# Altium project mini-inverter.PrjPcb
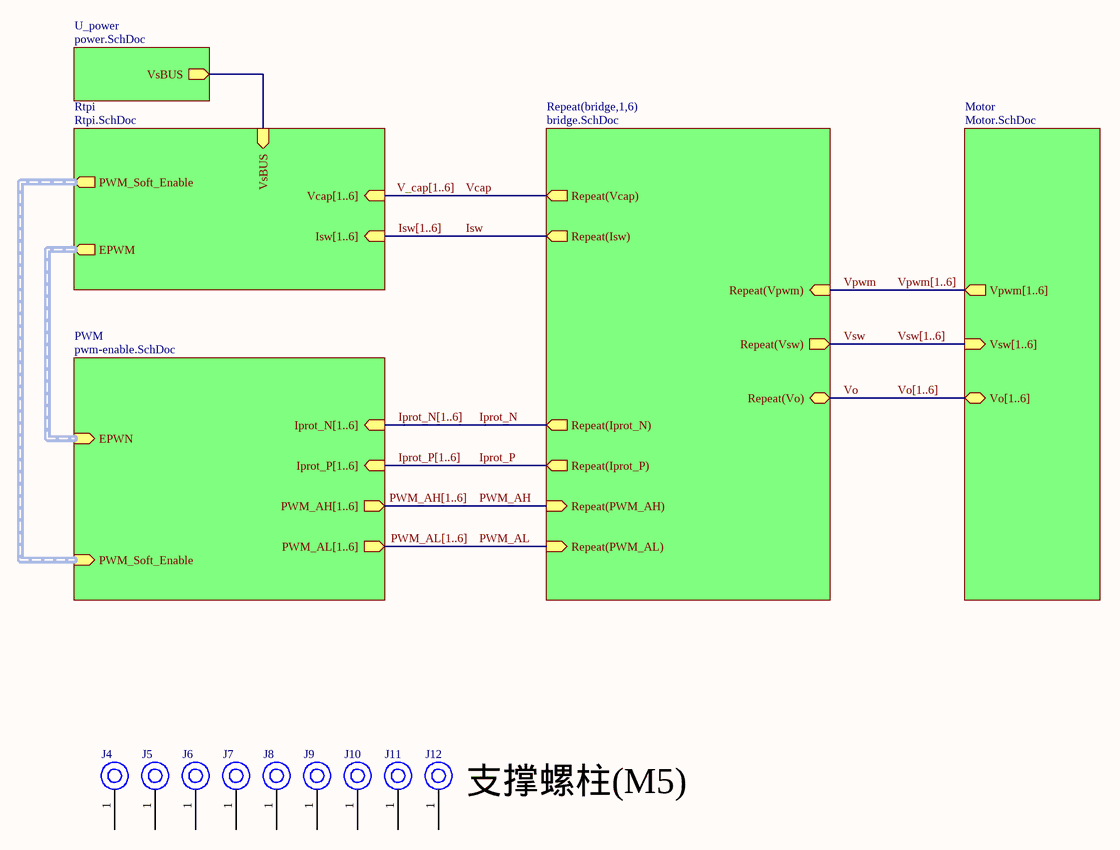
[diagram p0: mini-inverter.SchDoc]
6 sheets, 533 parts. Net scope: hierarchical (ports join the sheet entries above them; power ports are global).
Sheets:
  mini-inverter.SchDoc
    bridge1 = bridge.SchDoc
    bridge2 = bridge.SchDoc
    bridge3 = bridge.SchDoc
    bridge4 = bridge.SchDoc
    bridge5 = bridge.SchDoc
    bridge6 = bridge.SchDoc
    U_power = power.SchDoc
    PWM = pwm-enable.SchDoc
    Motor = motor.SchDoc
    Rtpi = rtpi.SchDoc

## Sheet mini-inverter.SchDoc
size A4; SheetNumber: 1; SheetTotal: 5

### Parts
J4  M5 Mounting Hole  [M5 Mounting Hole]  (value not drawn)
J5  M5 Mounting Hole  [M5 Mounting Hole]  (value not drawn)
J6  M5 Mounting Hole  [M5 Mounting Hole]  (value not drawn)
J7  M5 Mounting Hole  [M5 Mounting Hole]  (value not drawn)
J8  M5 Mounting Hole  [M5 Mounting Hole]  (value not drawn)
J9  M5 Mounting Hole  [M5 Mounting Hole]  (value not drawn)
J10  M5 Mounting Hole  [M5 Mounting Hole]  (value not drawn)
J11  M5 Mounting Hole  [M5 Mounting Hole]  (value not drawn)
J12  M5 Mounting Hole  [M5 Mounting Hole]  (value not drawn)

### Sub-sheets
Motor = Motor.SchDoc: Vsw[1..6] (in), Vpwm[1..6] (out), Vo[1..6] (bidir)
PWM = pwm-enable.SchDoc: EPWN (in, harness EPWM), PWM_Soft_Enable (in, harness PWM_EN), PWM_AH[1..6] (out), Iprot_P[1..6] (in), Iprot_N[1..6] (in), PWM_AL[1..6] (out)
Repeat(bridge,1,6) = bridge.SchDoc: Repeat(PWM_AH) (in), Repeat(PWM_AL) (in), Repeat(Iprot_P) (out), Repeat(Iprot_N) (out), Repeat(Vsw) (out), Repeat(Vpwm) (in), Repeat(Isw) (out), Repeat(Vcap) (out), Repeat(Vo) (bidir)
Rtpi = Rtpi.SchDoc: EPWM (out, harness EPWM), PWM_Soft_Enable (out, harness PWM_EN), Vcap[1..6] (in), Isw[1..6] (in), VsBUS (in)
U_power = power.SchDoc: VsBUS (out)

### Nets
Iprot_N: sheet Repeat(bridge,1,6)/Repeat(Iprot_N)
Iprot_P: sheet Repeat(bridge,1,6)/Repeat(Iprot_P)
Isw: sheet Repeat(bridge,1,6)/Repeat(Isw)
PWM_AH: sheet Repeat(bridge,1,6)/Repeat(PWM_AH)
PWM_AL: sheet Repeat(bridge,1,6)/Repeat(PWM_AL)
Vcap: sheet Repeat(bridge,1,6)/Repeat(Vcap)
Vo: sheet Repeat(bridge,1,6)/Repeat(Vo)
Vpwm: sheet Repeat(bridge,1,6)/Repeat(Vpwm)
VsBUS: sheet U_power/VsBUS, sheet Rtpi/VsBUS
Vsw: sheet Repeat(bridge,1,6)/Repeat(Vsw)

Not connected (* = marked no-connect by the designer): J4 1; J5 1; J6 1; J7 1; J8 1; J9 1; J10 1; J11 1; J12 1

### Buses and harness runs
bus Iprot_N[1..6] = sheet PWM/Iprot_N[1..6]
bus Iprot_P[1..6] = sheet PWM/Iprot_P[1..6]
bus Isw[1..6] = sheet Rtpi/Isw[1..6]
bus PWM_AH[1..6] = sheet PWM/PWM_AH[1..6]
bus PWM_AL[1..6] = sheet PWM/PWM_AL[1..6]
bus V_cap[1..6] = sheet Rtpi/Vcap[1..6]
bus Vo[1..6] = sheet Motor/Vo[1..6]
bus Vpwm[1..6] = sheet Motor/Vpwm[1..6]
bus Vsw[1..6] = sheet Motor/Vsw[1..6]
harness sheet PWM/EPWN = sheet Rtpi/EPWM
harness sheet PWM/PWM_Soft_Enable = sheet Rtpi/PWM_Soft_Enable

### Notes on the sheet
- (near J12) 支撑螺柱(M5)

## Sheet bridge.SchDoc
size A2; SheetNumber: 2; SheetTotal: 5
Used 6 times, as channels bridge1, bridge2, bridge3, bridge4, bridge5, bridge6. Parts and nets are listed once, with the designators drawn on the sheet.
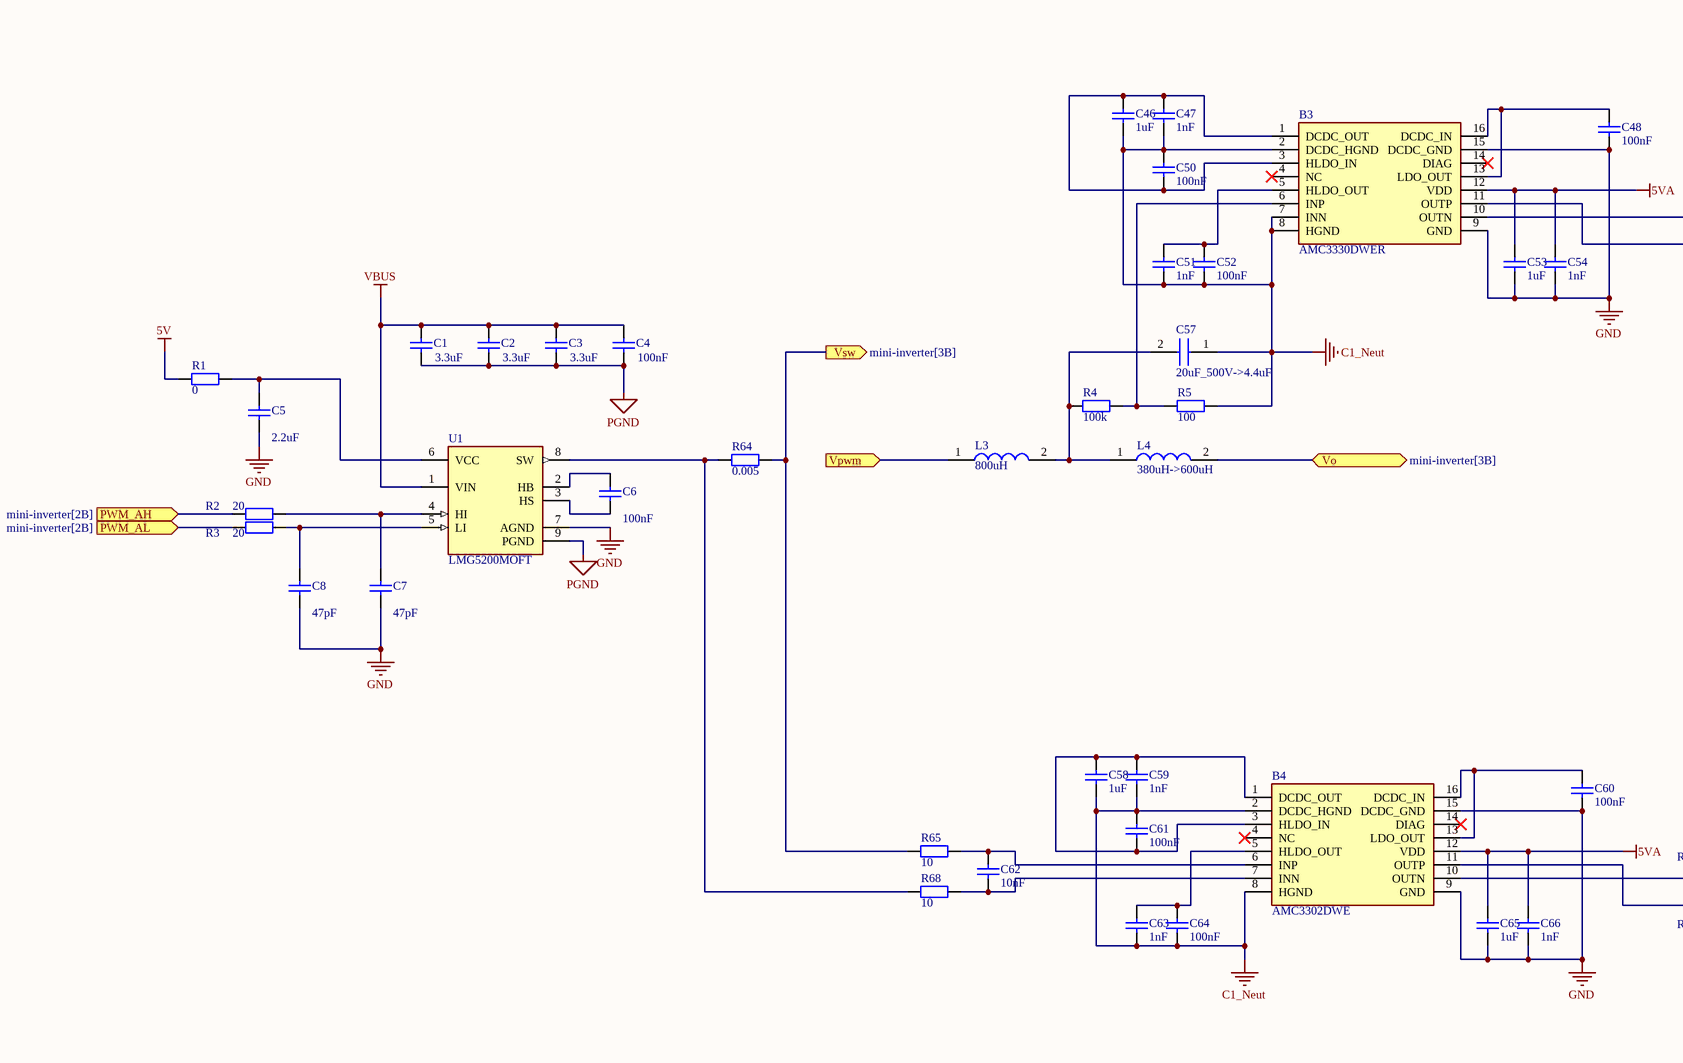
[diagram p1: bridge.SchDoc, left]
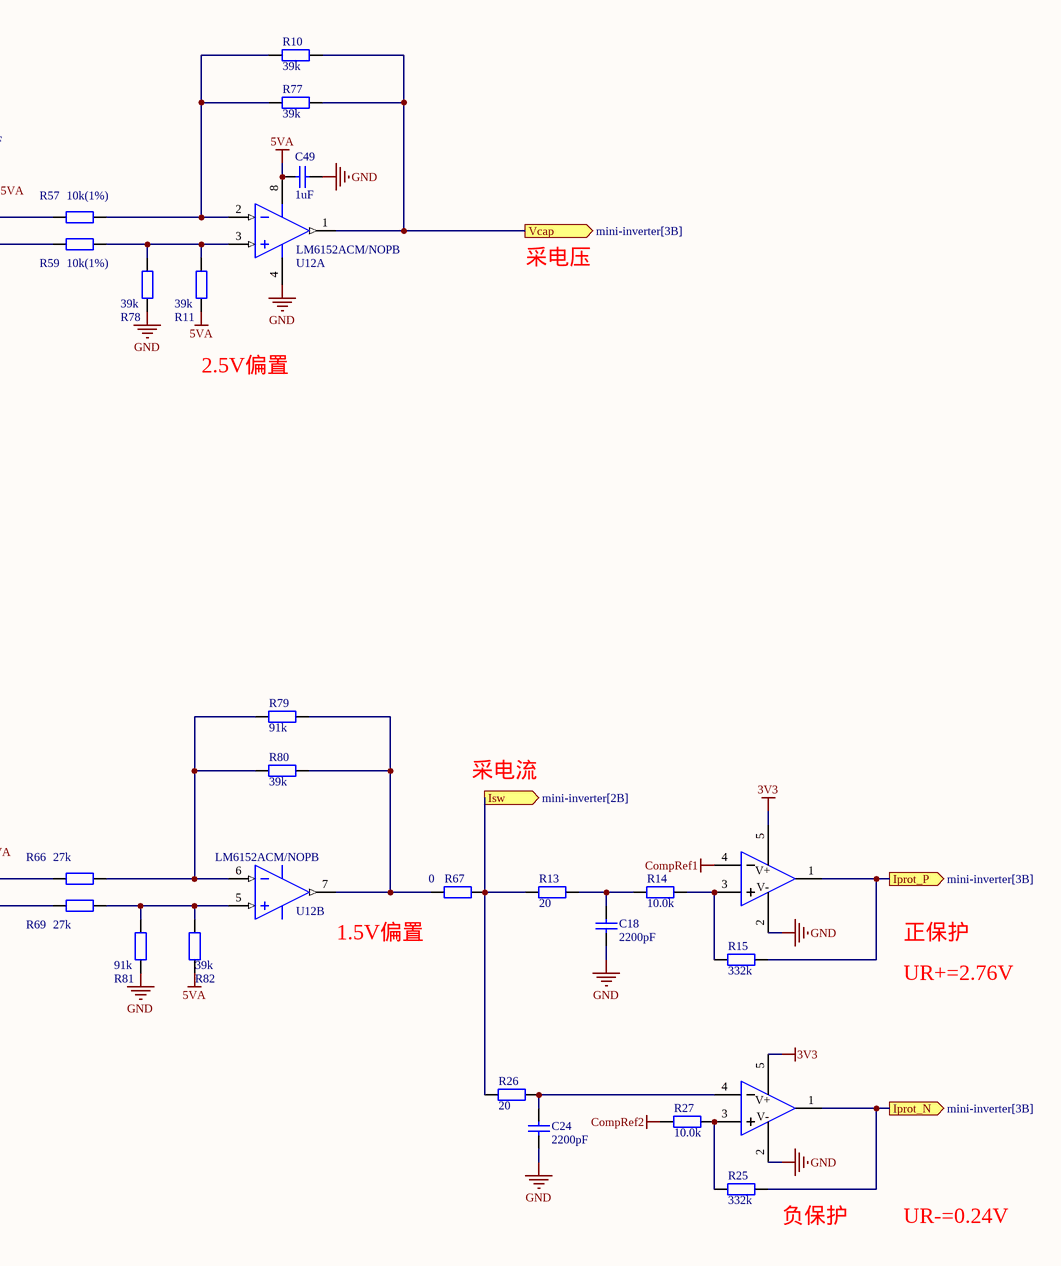
[diagram p2: bridge.SchDoc, right]

### Parts
B3  AMC3330DWER  [SOIC127P1030X265-16N]
B4  AMC3302DWE  [SOIC127P1030X265-16N]
C1  3.3uF  [CAPC1608X06N]
C2  3.3uF  [CAPC1608X06N]
C3  3.3uF  [CAPC1608X06N]
C4  100nF  [CAPC1608X06N]
C5  2.2uF  [CAPC1608X06N]
C6  100nF  [CAPC1608X06N]
C7  47pF  [CAPC1608X06N]
C8  47pF  [CAPC1608X06N]
C18  2200pF  [CAPC1608X06N]
C24  2200pF  [CAPC1608X06N]
C46  1uF  [CAPC1608X06N]
C47  1nF  [CAPC1608X06N]
C48  100nF  [CAPC1608X06N]
C49  1uF  [CAPC1608X06N]
C50  100nF  [CAPC1608X06N]
C51  1nF  [CAPC1608X06N]
C52  100nF  [CAPC1608X06N]
C53  1uF  [CAPC1608X06N]
C54  1nF  [CAPC1608X06N]
C57  20uF_500V->4.4uF  [Film Capacitor PHE450HF7220JR06L2]
C58  1uF  [CAPC1608X06N]
C59  1nF  [CAPC1608X06N]
C60  100nF  [CAPC1608X06N]
C61  100nF  [CAPC1608X06N]
C62  10nF  [CAPC1608X06N]
C63  1nF  [CAPC1608X06N]
C64  100nF  [CAPC1608X06N]
C65  1uF  [CAPC1608X06N]
C66  1nF  [CAPC1608X06N]
L3  800uH  [4mH Custom]
L4  380uH->600uH  [380uH Custom]
R1  0  [RESC1608X05N]
R2  20  [RESC1608X05N]
R3  20  [RESC1608X05N]
R4  100k  [RESC1608X05N]
R5  100  [RESC1608X05N]
R10  39k  [RESC1608X05N]
R11  39k  [RESC1608X05N]
R13  20  [RESC1608X05N]
R14  10.0k  [RESC1608X05N]
R15  332k  [RESC1608X05N]
R25  332k  [RESC1608X05N]
R26  20  [RESC1608X05N]
R27  10.0k  [RESC1608X05N]
R57  10k(1%)  [RESC1608X05N]
R59  10k(1%)  [RESC1608X05N]
R64  0.005  [RESC1608X05N]
R65  10  [RESC1608X05N]
R66  27k  [RESC1608X05N]
R67  0  [RESC1608X05N]
R68  10  [RESC1608X05N]
R69  27k  [RESC1608X05N]
R77  39k  [RESC1608X05N]
R78  39k  [RESC1608X05N]
R79  91k  [RESC1608X05N]
R80  39k  [RESC1608X05N]
R81  91k  [RESC1608X05N]
R82  39k  [RESC1608X05N]
U1  LMG5200MOFT  [FP-MOF0009A-MFG]
U5  TLV3201AIDBVR  [SOT-23-5_L3.0-W1.7-P0.95-LS2.8-BR]  (value not drawn)
U7  TLV3201AIDBVR  [SOT-23-5_L3.0-W1.7-P0.95-LS2.8-BR]  (value not drawn)
U12  LM6152ACM/NOPB  [D0008A_L]  (parts A,B of 2)

### Ports
Iprot_N (out, see mini-inverter[3B]), Iprot_P (out, see mini-inverter[3B]), Isw (out, see mini-inverter[2B]), PWM_AH (in, see mini-inverter[2B]), PWM_AL (in, see mini-inverter[2B]), Vcap (out, see mini-inverter[3B]), Vo (bidir, see mini-inverter[3B]), Vpwm (in), Vsw (out, see mini-inverter[3B])

### Nets
3V3: U5.5(VCC) U7.5(VCC)
5V: R1.2
5VA: B3.12(VDD) B4.12(VDD) C49.2 C53.1 C54.1 C65.1 C66.1 R11.1 R82.1 U12.8(V+)
C1_Neut: B3.2(DCDC_HGND) B3.7(INN) B3.8(HGND) B4.2(DCDC_HGND) B4.8(HGND) C46.2 C47.2 C50.1 C51.2 C52.2 C57.1 C58.2 C59.2 C61.1 C63.2 C64.2 R5.2
CompRef1: U5.4(IN-)
CompRef2: R27.2
GND: B3.9(GND) B3.15(DCDC_GND) B4.9(GND) B4.15(DCDC_GND) C5.1 C7.2 C8.2 C18.2 C24.2 C48.2 C49.1 C53.2 C54.2 C60.2 C65.2 C66.2 R78.1 R81.1 U1.7(AGND) U5.2(GND) U7.2(GND) U12.4(V-)
PGND: C1.1 C2.1 C3.1 C4.2 U1.9(PGND)
VBUS: C1.2 C2.2 C3.2 C4.1 U1.1(VIN)
Iprot_N: R25.1 U7.1(OUT) ; port Iprot_N
Iprot_P: R15.1 U5.1(OUT) ; port Iprot_P
Isw: R13.2 R26.2 R67.1 ; port Isw
PWM_AH: R2.2 ; port PWM_AH
PWM_AL: R3.2 ; port PWM_AL
Vcap: R10.1 R77.1 U12.1(OUTA) ; port Vcap
Vo: L4.2 ; port Vo
Vpwm: L3.1 ; port Vpwm
Vsw: R64.2 R65.1 ; port Vsw
NetB3_1: B3.1(DCDC_OUT) B3.3(HLDO_IN) C46.1 C47.1 C50.2
NetB3_5: B3.5(HLDO_OUT) C51.1 C52.1
NetB3_6: B3.6(INP) R4.2 R5.1
NetB3_10: B3.10(OUTN) R57.2
NetB3_11: B3.11(OUTP) R59.1
NetB3_13: B3.13(LDO_OUT) B3.16(DCDC_IN) C48.1
NetB4_1: B4.1(DCDC_OUT) B4.3(HLDO_IN) C58.1 C59.1 C61.2
NetB4_5: B4.5(HLDO_OUT) C63.1 C64.1
NetB4_6: B4.6(INP) C62.1 R65.2
NetB4_7: B4.7(INN) C62.2 R68.2
NetB4_10: B4.10(OUTN) R66.2
NetB4_11: B4.11(OUTP) R69.1
NetB4_13: B4.13(LDO_OUT) B4.16(DCDC_IN) C60.1
NetC5_2: C5.2 R1.1 U1.6(VCC)
NetC6_1: C6.1 U1.2(HB)
NetC6_2: C6.2 U1.3(HS)
NetC7_1: C7.1 R2.1 U1.4(HI)
NetC8_1: C8.1 R3.1 U1.5(LI)
NetC18_1: C18.1 R13.1 R14.2
NetC24_1: C24.1 R26.1 U7.4(IN-)
NetC57_2: C57.2 L3.2 L4.1 R4.1
NetR10_2: R10.2 R57.1 R77.2 U12.2(INA-)
NetR11_2: R11.2 R59.2 R78.2 U12.3(INA+)
NetR14_1: R14.1 R15.2 U5.3(IN+)
NetR25_2: R25.2 R27.1 U7.3(IN+)
NetR64_1: R64.1 R68.1 U1.8(SW)
NetR66_1: R66.1 R79.1 R80.2 U12.6(INB-)
NetR67_2: R67.2 R79.2 R80.1 U12.7(OUTB)
NetR69_2: R69.2 R81.2 R82.2 U12.5(INB+)

Not connected (* = marked no-connect by the designer): B3 4(NC)* 14(DIAG)*; B4 4(NC)* 14(DIAG)*

### Channels
bridge1: designators end in _1; ports Iprot_N=Iprot_N1 Iprot_P=Iprot_P1 Isw=Isw1 PWM_AH=PWM_AH1 PWM_AL=PWM_AL1 Vcap=Vcap1 Vo=V_out_1 Vpwm=Vpwm1 Vsw=Vsw1
bridge2: designators end in _2; ports Iprot_N=Iprot_N2 Iprot_P=Iprot_P2 Isw=Isw2 PWM_AH=PWM_AH2 PWM_AL=PWM_AL2 Vcap=Vcap2 Vo=V_out_2 Vpwm=Vpwm2 Vsw=Vsw2
bridge3: designators end in _3; ports Iprot_N=Iprot_N3 Iprot_P=Iprot_P3 Isw=Isw3 PWM_AH=PWM_AH3 PWM_AL=PWM_AL3 Vcap=Vcap3 Vo=V_out_3 Vpwm=Vpwm3 Vsw=Vsw3
bridge4: designators end in _4; ports Iprot_N=Iprot_N4 Iprot_P=Iprot_P4 Isw=Isw4 PWM_AH=PWM_AH4 PWM_AL=PWM_AL4 Vcap=Vcap4 Vo=V_out_4 Vpwm=Vpwm4 Vsw=Vsw4
bridge5: designators end in _5; ports Iprot_N=Iprot_N5 Iprot_P=Iprot_P5 Isw=Isw5 PWM_AH=PWM_AH5 PWM_AL=PWM_AL5 Vcap=Vcap5 Vo=V_out_5 Vpwm=Vpwm5 Vsw=Vsw5
bridge6: designators end in _6; ports Iprot_N=Iprot_N6 Iprot_P=Iprot_P6 Isw=Isw6 PWM_AH=PWM_AH6 PWM_AL=PWM_AL6 Vcap=Vcap6 Vo=V_out_6 Vpwm=Vpwm6 Vsw=Vsw6

### Notes on the sheet
- 采电压
- 2.5V偏置
- 采电流
- (near U12) 1.5V偏置
- 正保护
- UR+=2.76V
- (near R25) 负保护
- UR-=0.24V
- (in symbol TLV3201AIDBVR) V+; V-

### Library data of the parts
B3 = AMC3330DWER: Isolation Amplifiers +/-1-V input, precision reinforced isolated amplifier with integrated DC/DC converter and high CMTI 16-SOIC -40 to 125; Manufacturer_Name: Texas Instruments; Geometry.Height: 2.65mm; Manufacturer_Part_Number: AMC3330DWER; Mouser Part Number: 595-AMC3330DWER; Mouser Price/Stock: https://www.mouser.co.uk/ProductDetail/Texas-Instruments/AMC3330DWER?qs=zW32dvEIR3u5qLqnY17MoA%3D%3D; Arrow Part Number: AMC3330DWER; Arrow Price/Stock: https://www.arrow.com/en/products/amc3330dwer/texas-instruments?region=nac; Datasheet Link: https://www.ti.com/lit/ds/symlink/amc3330.pdf?ts=1627904955935&ref_url=https%253A%252F%252Fwww.ti.com%252Fproduct%252FAMC3330
B4 = AMC3302DWE: Isolation Amplifiers +/-50-mV input, precision reinforced isolated amplifier with integrated DC/DC converter 16-SOIC -40 to 125; Manufacturer_Name: Texas Instruments; Geometry.Height: 2.65mm; Manufacturer_Part_Number: AMC3302DWE; Mouser Part Number: 595-AMC3302DWE; Mouser Price/Stock: https://www.mouser.co.uk/ProductDetail/Texas-Instruments/AMC3302DWE?qs=DRkmTr78QAT3OfY8Rd%252BeWA%3D%3D; Arrow Part Number: AMC3302DWE; Arrow Price/Stock: https://www.arrow.com/en/products/amc3302dwe/texas-instruments?region=nac; Datasheet Link: https://www.ti.com/lit/ds/symlink/amc3302.pdf?ts=1643366130509
C1-C8 C18 C24 C46-C54 C58-C66 = Cap: Capacitor; Published: 8-Jun-2000; LatestRevisionDate: 17-Jul-2002; LatestRevisionNote: Re-released for DXP Platform.; PackageReference: RAD-0.3; Publisher: Altium Limited; PackageDescription: Radial Cap, Thru-Hole; 2 Leads; 0.3 in Pin Spacing
  C1-C3: Value: 3.3uF
  C4 C6 C48 C50 C52 C60 C61 C64: Value: 100nF
  C5: Value: 2.2uF
  C7 C8: Value: 47pF
  C18 C24: Value: 2200pF
  C46 C49 C53 C58 C65: Value: 1uF
  C47 C51 C54 C59 C63 C66: Value: 1nF
  C62: Value: 10nF
C57 = PHE450HF7220JR06L2: KEMET PHE450 Metallised Polypropylene Film Capacitor, 180 V ac, 250 V dc, ±5%, 2.2μF, Through Hole; Datasheet Link: https://docs.rs-online.com/a458/0900766b817170df.pdf; Height: 24.5mm; Manufacturer_Name: KEMET; Manufacturer_Part_Number: PHE450HF7220JR06L2
L3 = 4mH Custom Inductor
L4 = 380uH Custom Inductor
R1-R5 R13-R15 R25-R27 R64 R65 R68 = 0603 100KΩ (1003) 1%_4: 贴片电阻; Value: 1MΩ(1%); ComponentLink1Description: 供应商链接; ComponentLink1URL: http://www.szlcsc.com/product/details_26546.html; Package: 0603; Supplier: LC; SuppliersPartNumber: C25803
R10 R11 R57 R59 R67 R77-R82 = Res2: Resistor; Published: 8-Jun-2000; LatestRevisionDate: 17-Jul-2002; LatestRevisionNote: Re-released for DXP Platform.; PackageReference: AXIAL-0.4; Publisher: Altium Limited; PackageDescription: Axial Device, Thru-Hole; 2 Leads; 0.4 in Pin Spacing
  R10 R11 R77 R78 R80 R82: Value: 39k
  R57 R59: Value: 10k(1%)
  R67: Value: 0
  R79 R81: Value: 91k
R66 R69 = Res2: Resistor; Value: 10k(1%); Published: 8-Jun-2000; LatestRevisionDate: 17-Jul-2002; LatestRevisionNote: Re-released for DXP Platform.; PackageReference: AXIAL-0.4; Publisher: Altium Limited; PackageDescription: Axial Device, Thru-Hole; 2 Leads; 0.4 in Pin Spacing
U1 = CMP-04912-000022-2: None; Output Current per Channel: 10A; Interface: Logic; Min Operating Temperature: -40°C; Mount: Surface Mount; Case/Package: QFN; RoHS Compliant: Yes; Packaging: Cut Tape; Max Operating Temperature: 125°C; Number of Pins: 9
U5 U7 = TLV3201AIDBVR: Manufacturer: TI(德州仪器); Add into BOM: yes; Input Offset Voltage (Vos): 1mV; Input Bias Current (Ib): 5nA; Propagation Delay Time: 40ns; Input Hysteresis Voltage (Vhys): 1.2mV; Common Mode Rejection Ratio (CMRR): 70dB; Supply Voltage: 2.7V~5.5V; Output Type: 推挽; Supply Current: 40uA; Symbol: TLV3201AIDBVR; Device: TLV3201AIDBVR; LCSC Part Name: TLV3201AIDBVR; Supplier Part: C105188; Manufacturer Part: TLV3201AIDBVR; Supplier Footprint: SOT-23-5; JLCPCB Part Class: Extended Part; Datasheet: https://www.ti.com/cn/lit/gpn/tlv3201; Supplier: LCSC; Convert to PCB: yes; Output Mode: -; Rail-to-Rail: -; Operating Temperature: -40℃~+125℃
U12 = LM6152ACM/NOPB: Dual and Quad 75 MHz GBW Rail-to-Rail I/O Operational Amplifiers, 8-pin Narrow SOIC, Pb-Free; Manufacturer: Texas Instruments; PackageTopMarking: NSZXTT*LM61*52ACM; PowerWise: Y; Package Reference: D0008A; Code_JEDEC: MS-012-AA; Code_IPC: SOIC127P600-8; PinCount: 8; ComponentLink1URL: http://www.ti.com/general/docs/lit/getliterature.tsp?genericPartNumber=LM6152&fileType=pdf; PackageDescription: SOIC Narrow, 4.9 x 3.9 x 1.45mm, 8 Lead, 1.27mm Pitch; CompType: Amplifiers; RoHS: Y; ComponentLink1Description: Datasheet URL

## Sheet power.SchDoc
size A3
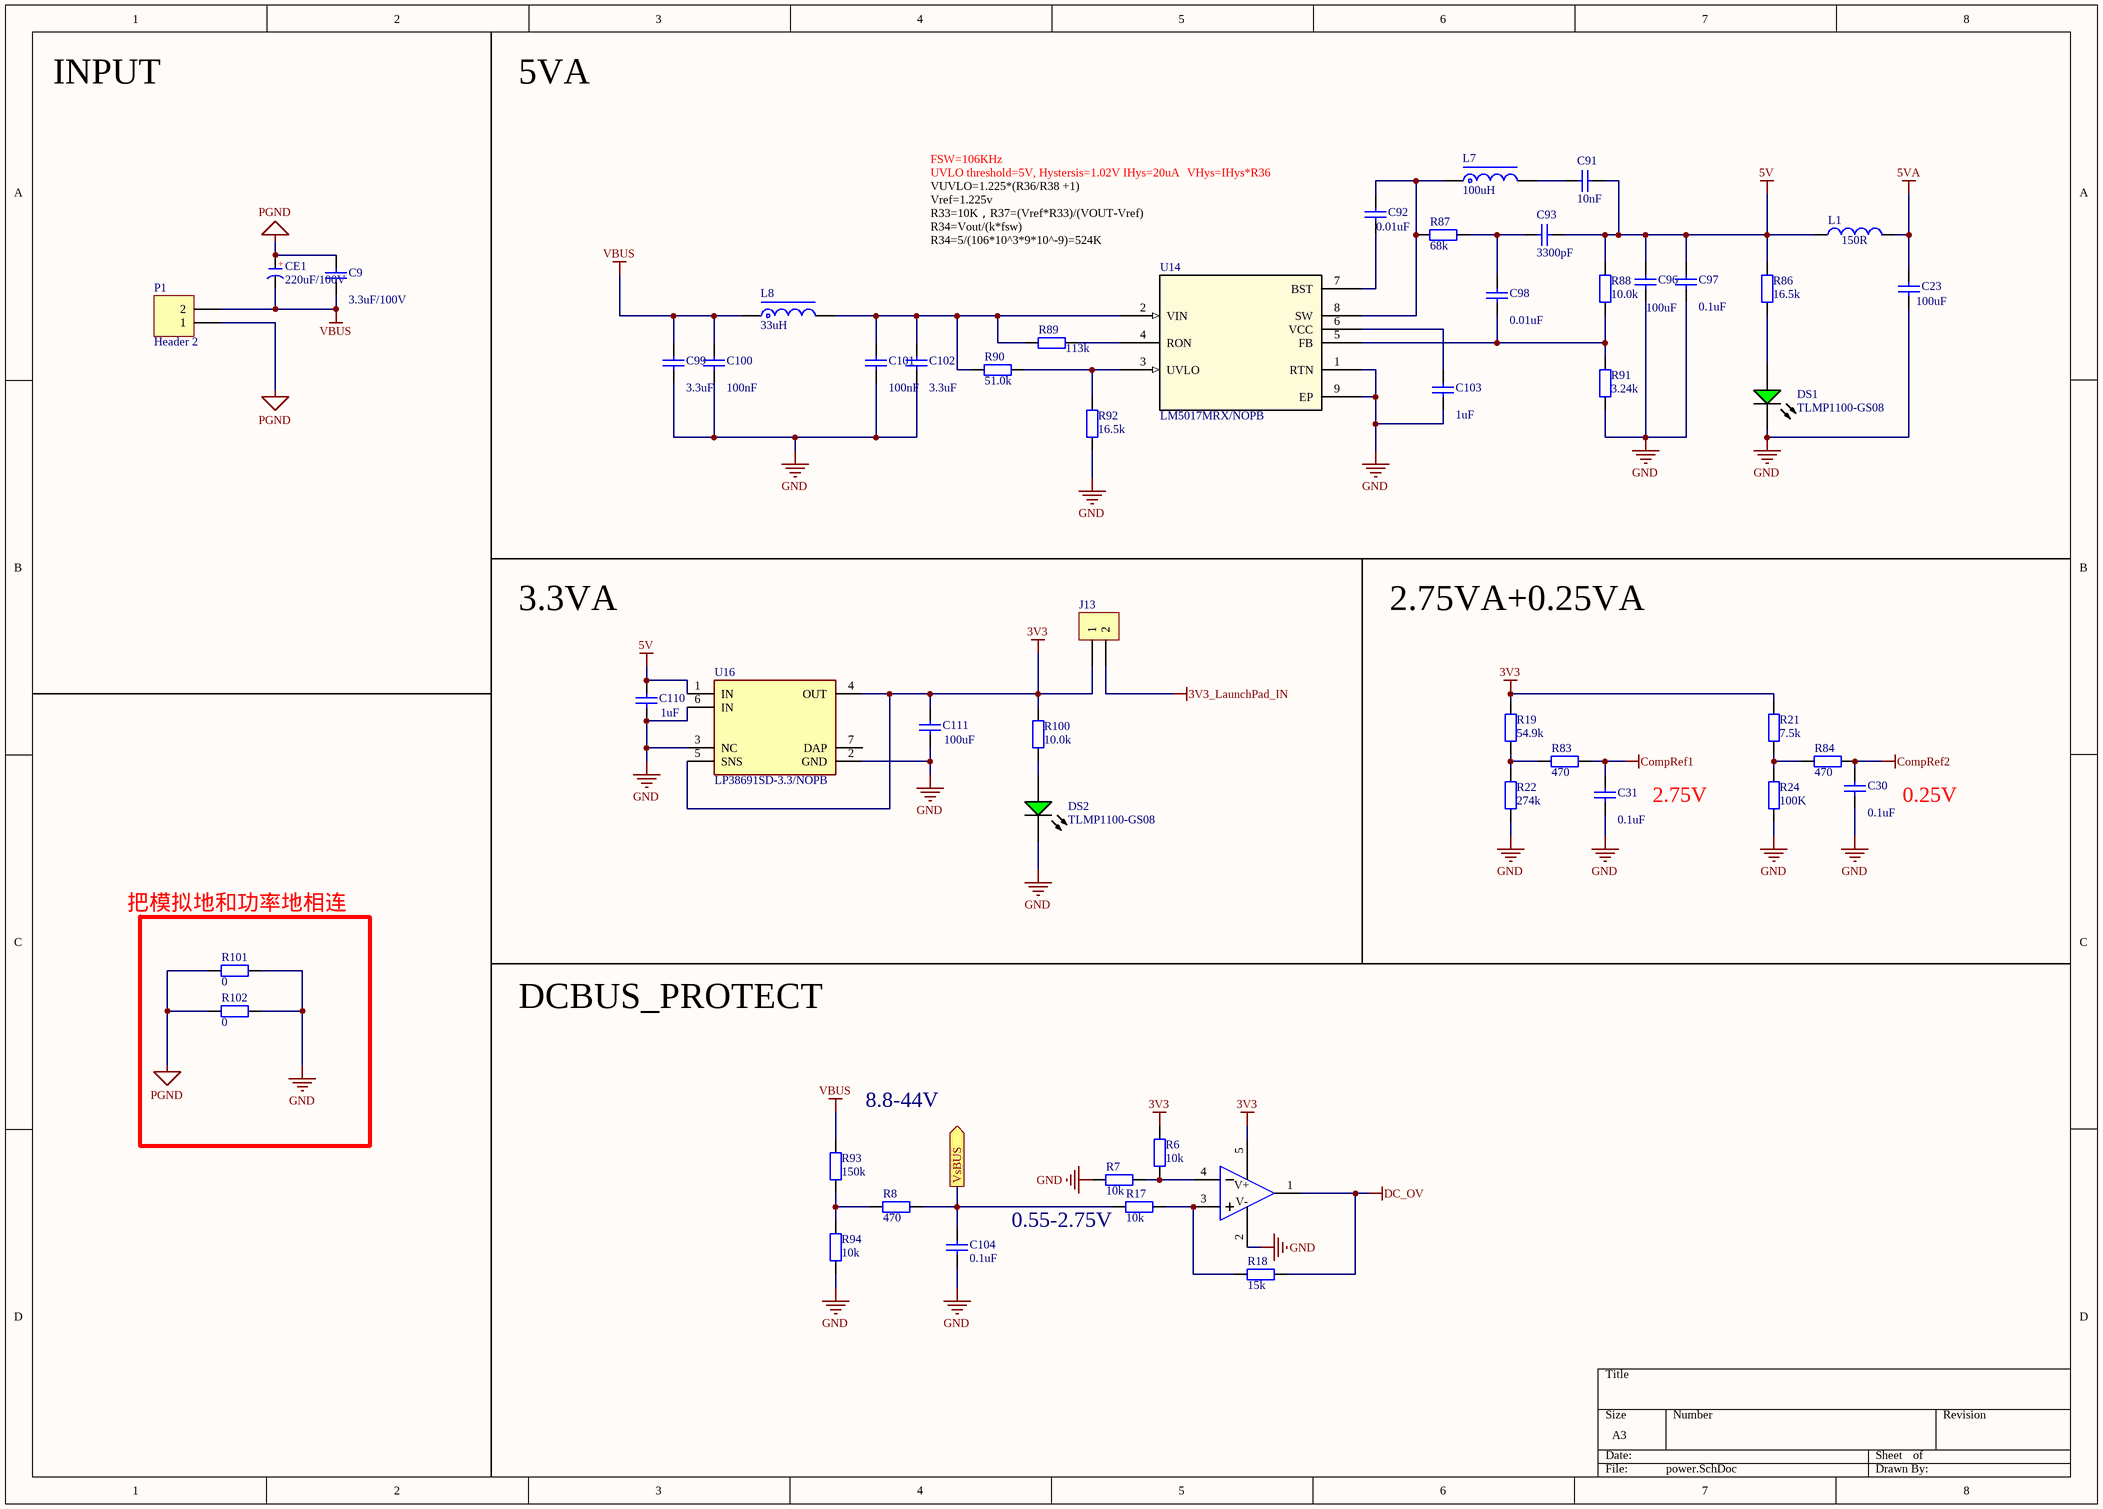
[diagram p3: power.SchDoc]

### Parts
C9  3.3uF/100V  [CAPC1608X06N]
C23  100uF  [CAPC1608X06N]
C30  0.1uF  [CAPC1608X06N]
C31  0.1uF  [CAPC1608X06N]
C91  10nF  [CAPC1608X06N]
C92  0.01uF  [CAPC1608X06N]
C93  3300pF  [CAPC1608X06N]
C96  100uF  [CAPC1608X06N]
C97  0.1uF  [CAPC1608X06N]
C98  0.01uF  [CAPC1608X06N]
C99  3.3uF  [CAPC1608X06N]
C100  100nF  [CAPC1608X06N]
C101  100nF  [CAPC1608X06N]
C102  3.3uF  [CAPC1608X06N]
C103  1uF  [CAPC1608X06N]
C104  0.1uF  [CAPC1608X06N]
C110  1uF  [CAPC1608X06N]
C111  100uF  [CAPC1608X06N]
CE1  220uF/100V  [CAP 5.0*12.5*20]
DS1  TLMP1100-GS08  [VISH-TLMX1100_V]
DS2  TLMP1100-GS08  [VISH-TLMX1100_V]
J13  CON2  [DG1282-5.0]  (value not drawn)
L1  value 150R  [IND-SMD_L5.5-W5.2]  (hidden comment: Inductor)
L7  100uH  [NR4018]
L8  33uH  [NR2520]
P1  Header 2  [HDR1X2]
R6  10k  [RESC1608X05N]
R7  10k  [RESC1608X05N]
R8  470  [RESC1608X05N]
R17  10k  [RESC1608X05N]
R18  15k  [RESC1608X05N]
R19  54.9k  [RESC1608X05N]
R21  7.5k  [RESC1608X05N]
R22  274k  [RESC1608X05N]
R24  100K  [RESC1608X05N]
R83  470  [RESC1608X05N]
R84  470  [RESC1608X05N]
R86  16.5k  [RESC1608X05N]
R87  68k  [RESC1608X05N]
R88  10.0k  [RESC1608X05N]
R89  113k  [RESC1608X05N]
R90  51.0k  [RESC1608X05N]
R91  3.24k  [RESC1608X05N]
R92  16.5k  [RESC1608X05N]
R93  150k  [RESC1608X05N]
R94  10k  [RESC1608X05N]
R100  10.0k  [RESC1608X05N]
R101  0  [RESC1608X05N]
R102  0  [RESC1608X05N]
U6  TLV3201AIDBVR  [SOT-23-5_L3.0-W1.7-P0.95-LS2.8-BR]  (value not drawn)
U14  LM5017MRX/NOPB  [DDA8_3P1X2P41]
U16  LP38691SD-3.3/NOPB  [FP-NGG0006A-MFG]

### Ports
VsBUS (out)

### Nets
3V3: C111.2 J13.1 R6.1 R19.2 R21.2 R100.2 U6.5(VCC) U16.4(OUT) U16.5(SNS)
3V3_LaunchPad_IN: J13.2
5V: C91.2 C93.1 C96.2 C97.2 C110.2 L1.1 R86.2 R88.2 U16.1(IN)
5VA: C23.2 L1.2
CompRef1: C31.2 R83.1
CompRef2: C30.2 R84.1
DC_OV: R18.1 U6.1(OUT)
GND: C23.1 C30.1 C31.1 C96.1 C97.1 C99.2 C100.2 C101.2 C102.1 C103.1 C104.2 C110.1 C111.1 DS1.2(K) DS2.2(K) R7.2 R22.1 R24.1 R91.1 R92.1 R94.1 R101.1 R102.1 U6.2(GND) U14.1(RTN) U14.9(EP) U16.2(GND) U16.3(NC) U16.6(IN)
PGND: C9.2 CE1.1(A) P1.1 R101.2 R102.2
VBUS: C9.1 C99.1 C100.1 CE1.2(K) L8.1 P1.2 R93.2
VsBUS: C104.1 R8.1 R17.2 ; port VsBUS
NetC91_1: C91.1 L7.2
NetC92_1: C92.1 U14.7(BST)
NetC92_2: C92.2 L7.1 R87.2 U14.8(SW)
NetC93_2: C93.2 C98.2 R87.1
NetC98_1: C98.1 R88.1 R91.2 U14.5(FB)
NetC101_1: C101.1 C102.2 L8.2 R89.1 R90.1 U14.2(VIN)
NetC103_2: C103.2 U14.6(VCC)
NetDS1_1: DS1.1(A) R86.1
NetDS2_1: DS2.1(A) R100.1
NetR6_2: R6.2 R7.1 U6.4(IN-)
NetR8_2: R8.2 R93.1 R94.2
NetR17_1: R17.1 R18.2 U6.3(IN+)
NetR19_1: R19.1 R22.2 R83.2
NetR21_1: R21.1 R24.2 R84.2
NetR89_2: R89.2 U14.4(RON)
NetR90_2: R90.2 R92.2 U14.3(UVLO)

Not connected (* = marked no-connect by the designer): U16 7(DAP)

### Notes on the sheet
- INPUT
- 5VA
- FSW=106KHz
- UVLO threshold=5V, Hystersis=1.02V IHys=20uA
- VHys=IHys*R36
- Vref=1.225v
- R33=10K，R37=(Vref*R33)/(VOUT-Vref)
- R34=Vout/(k*fsw)
- R34=5/(106*10^3*9*10^-9)=524K
- VUVLO=1.225*(R36/R38 +1)
- 3.3VA
- 2.75VA+0.25VA
- 2.75V
- 0.25V
- 把模拟地和功率地相连
- DCBUS_PROTECT
- (near R93) 8.8-44V
- (near R17) 0.55-2.75V
- (in symbol CE) +
- (in symbol TLV3201AIDBVR) V+; V-

### Library data of the parts
C9 C23 C30 C31 C91-C93 C96-C104 C110 C111 = Cap: Capacitor; Published: 8-Jun-2000; LatestRevisionDate: 17-Jul-2002; LatestRevisionNote: Re-released for DXP Platform.; PackageReference: RAD-0.3; Publisher: Altium Limited; PackageDescription: Radial Cap, Thru-Hole; 2 Leads; 0.3 in Pin Spacing
  C9: Value: 3.3uF/100V
  C23 C96 C111: Value: 100uF
  C30 C31 C97 C104: Value: 0.1uF
  C91: Value: 10nF
  C92 C98: Value: 0.01uF
  C93: Value: 3300pF
  C99 C102: Value: 3.3uF
  C100 C101: Value: 100nF
  C103 C110: Value: 1uF
CE1 = CE: 直插电解电容; 淘宝ID: 封装库来自淘宝 ID：黄晶宝石; BOM名称: 直插电解电容; 联系售后: https://shop463601444.taobao.com
DS1 DS2 = CMP-1666-00027-1_1: LED, RED, 2.1 V, -40 to 100 degC, 2-Pin SMD (0603), RoHS, Tape and Reel; Type (Capacitors): C0G; Resistance: 100000000000 Ohm; Capacitance: 12 pF; Voltage Rating: 50 V; Tolerance: 5%; Min Operating Temperature: -55degC; REACH SVHC: No SVHC; ComponentLink2Description: Datasheet; ComponentLink1URL: http://www.vishay.com/; Width: 0.8 mm; Package Quantity: 4000; PackageReference: TLMX1100; ComponentLink2URL: http://www.vishay.com/docs/83173/tlmb1100.pdf; Case/Package: 0603; Case Code (Metric): 1608; Packaging: Tape and Reel; Pins: 2; ComponentLink1Description: Manufacturer URL; Max Operating Temperature: 125degC; Height: 0.8 mm; Length: 1.6 mm; Mount: Surface Mount; PackageDescription: 2-Pin Surface Mount Device, Body 1.6 x 0.8 mm; DatasheetVersion: Rev. 2.7, 03/2016; Case Code (Imperial): 0603; Voltage Rating (DC): 50 V; RoHSCompliant: True; Radiation Hardening: No
L1 = Inductor: Code_IEC: 1005; Published: 8-Jun-2000; LatestRevisionDate: 29-May-2009; LatestRevisionNote: IPC-7351 Footprint Added.; PackageReference: 0402-A; Publisher: Altium Limited; Code_JEITA: 0402; PackageDescription: Chip Inductor
L7 L8 = L-NR: NR磁胶电感; 版权归属: 来自淘宝 ID：黄晶宝石; BOM名称: NR磁胶电感; 联系售后: https://shop463601444.taobao.com
P1 = Header 2: Header, 2-Pin; LatestRevisionDate: 17-Jul-2002; LatestRevisionNote: Re-released for DXP Platform.; Publisher: Altium Limited
R6-R8 R17-R19 R21 R22 R24 R83 R84 R86-R94 R100-R102 = 0603 100KΩ (1003) 1%_4: 贴片电阻; Value: 1MΩ(1%); ComponentLink1Description: 供应商链接; ComponentLink1URL: http://www.szlcsc.com/product/details_26546.html; Package: 0603; Supplier: LC; SuppliersPartNumber: C25803
U6 = TLV3201AIDBVR: as U5 on sheet bridge; Symbol: TLV3201AIDBVR; Device: TLV3201AIDBVR; LCSC Part Name: TLV3201AIDBVR; Supplier Part: C105188; Manufacturer Part: TLV3201AIDBVR; Supplier Footprint: SOT-23-5; JLCPCB Part Class: Extended Part; Datasheet: https://www.ti.com/cn/lit/gpn/tlv3201; Supplier: LCSC; Convert to PCB: yes; Output Mode: -; Rail-to-Rail: -; Operating Temperature: -40℃~+125℃
U14 = LM5017MRXNOPB: No Description Available; Mfr_Name: Texas Instruments; Copyright: Copyright (C) 2024 Ultra Librarian. All rights reserved.; Manufacturer_Part_Number: LM5017MRX/NOPB; RefDes: RefDes; Type: DEV
U16 = CMP-0062-01590-5: IC REG LINEAR 3.3V 500MA 6WSON; Min Input Voltage: 2.7V; Number of Regulators: 1; Polarity: Positive; Dropout Voltage: 330mV; Output Type: Fixed; Output Voltage Accuracy: 2%; Max Input Voltage: 10V; Quiescent Current: 100uA; Max Output Current: 500mA; Output Current: 500mA; Package Quantity: 1000; Nominal Output Voltage: 3.3V; Number of Pins: 6; Number of Outputs: 1; Length: 3mm; Output Voltage: 3.3V; Height: 0.86mm; REACH SVHC: No SVHC; Accuracy: 2%; Lead Free: Lead Free; Mount: Surface Mount; Packaging: Tape and Reel; Contact Plating: Tin; Max Operating Temperature: 125°C; Min Operating Temperature: -40°C; Radiation Hardening: No; Width: 3mm

## Sheet pwm-enable.SchDoc
size A3
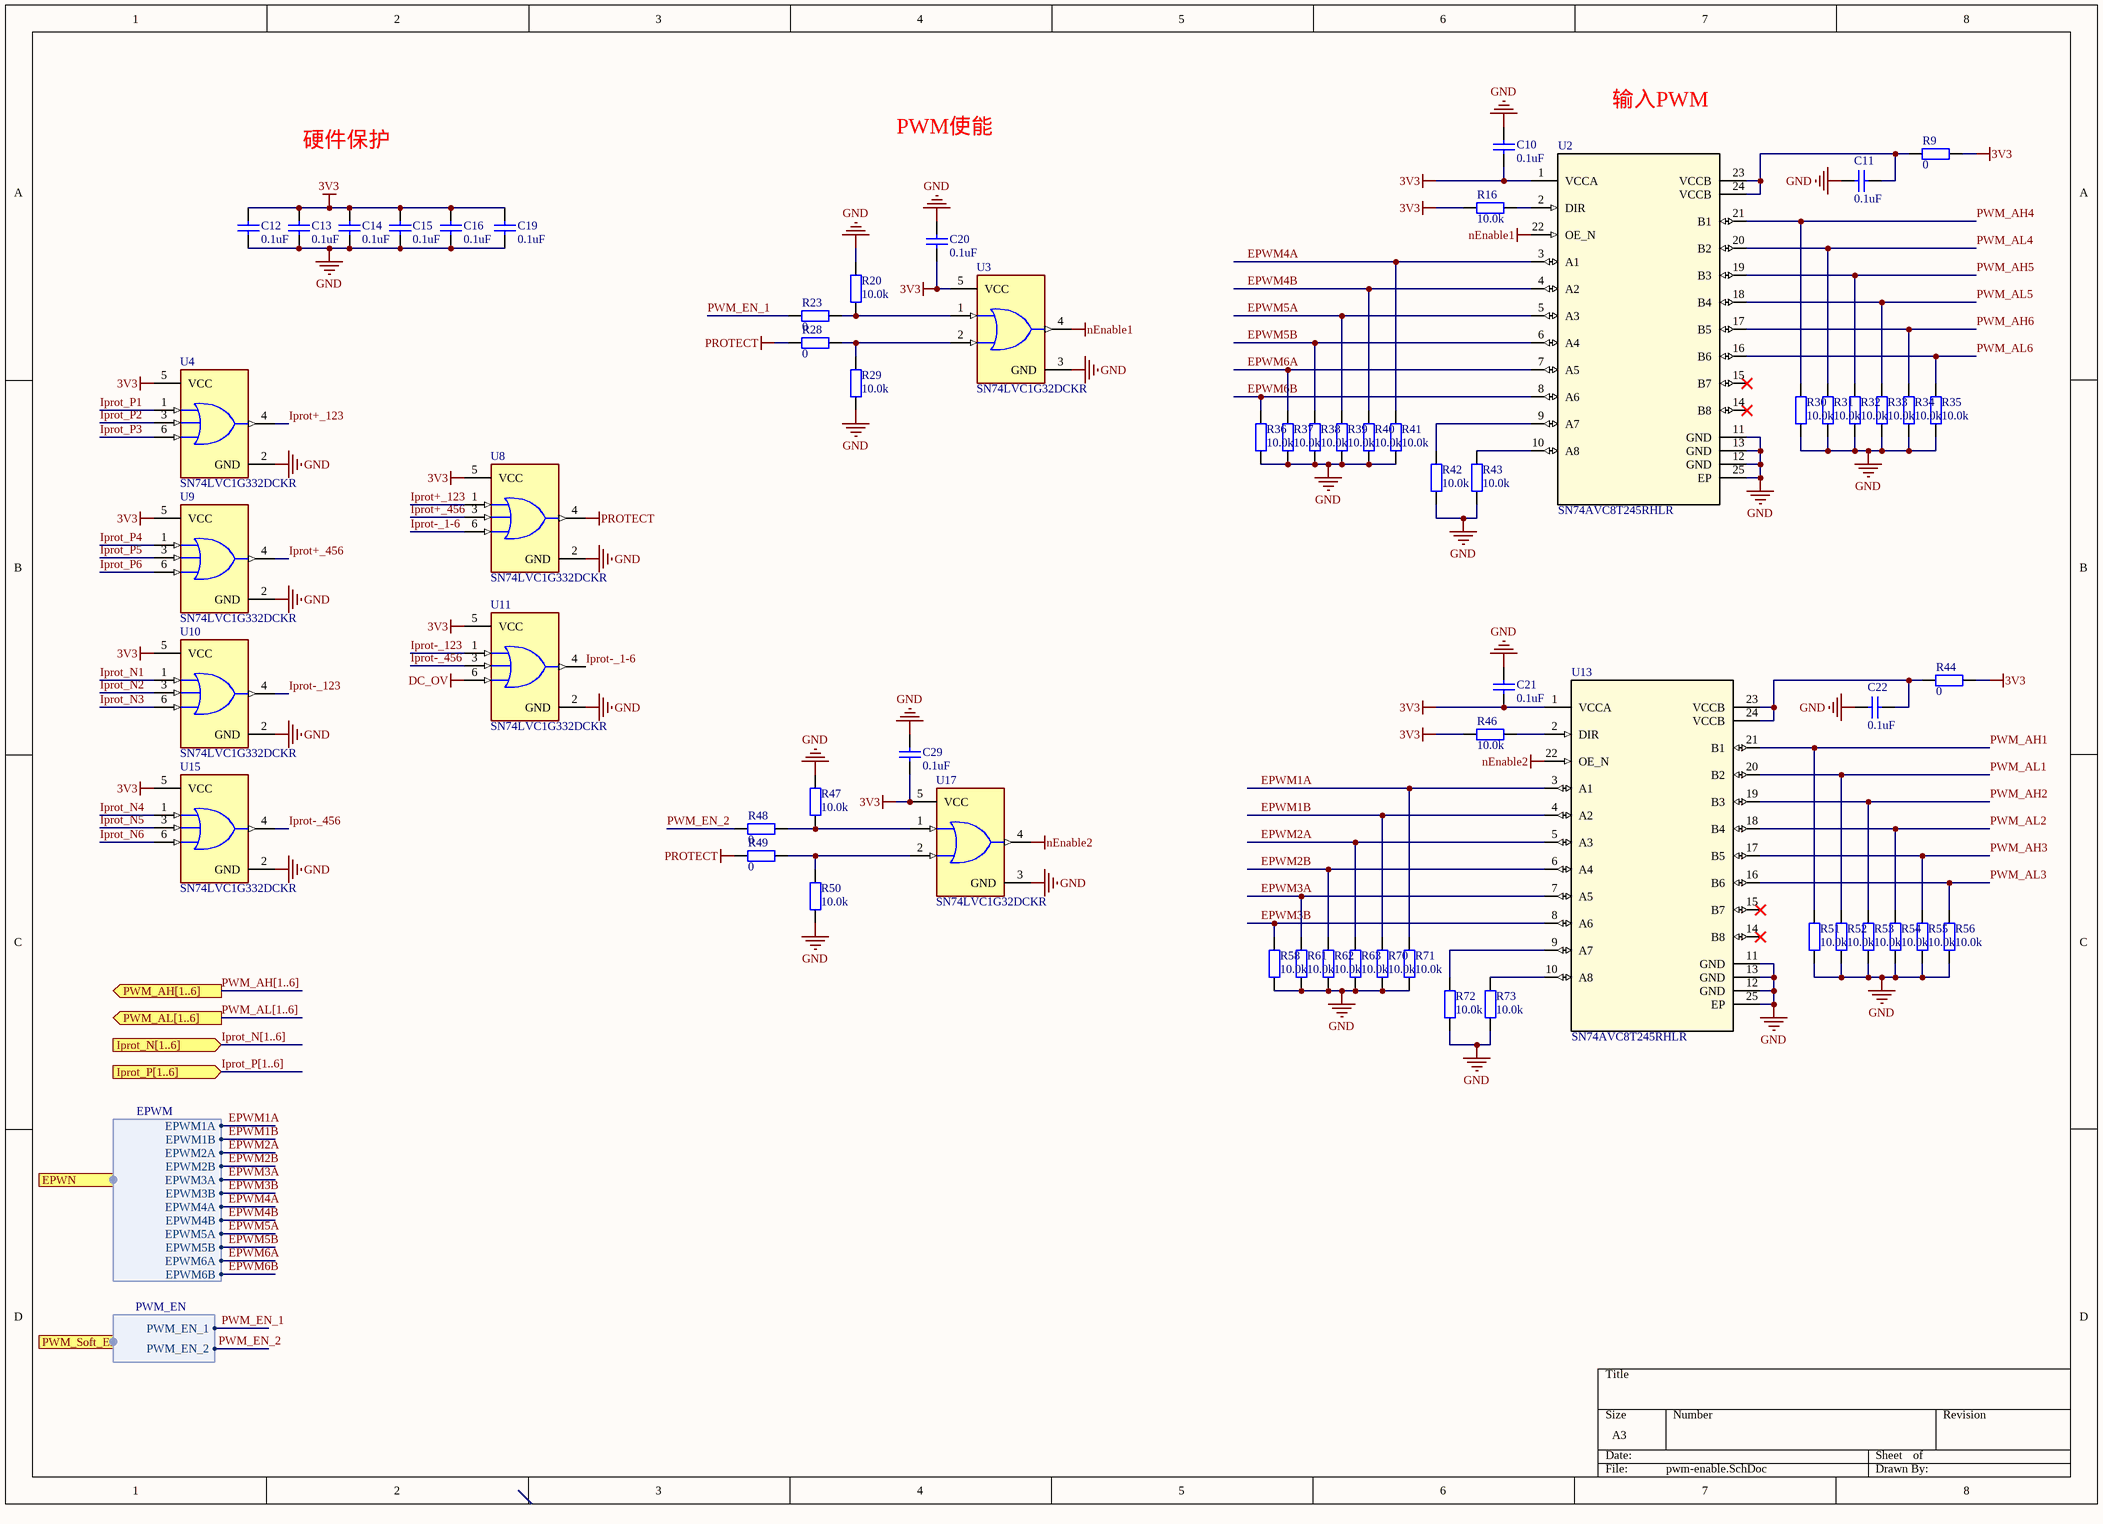
[diagram p4: pwm-enable.SchDoc]

### Parts
C10  0.1uF  [CAPC1608X06N]
C11  0.1uF  [CAPC1608X06N]
C12  0.1uF  [CAPC1608X06N]
C13  0.1uF  [CAPC1608X06N]
C14  0.1uF  [CAPC1608X06N]
C15  0.1uF  [CAPC1608X06N]
C16  0.1uF  [CAPC1608X06N]
C19  0.1uF  [CAPC1608X06N]
C20  0.1uF  [CAPC1608X06N]
C21  0.1uF  [CAPC1608X06N]
C22  0.1uF  [CAPC1608X06N]
C29  0.1uF  [CAPC1608X06N]
R9  0  [RESC1608X05N]
R16  10.0k  [RESC1608X05N]
R20  10.0k  [RESC1608X05N]
R23  0  [RESC1608X05N]
R28  0  [RESC1608X05N]
R29  10.0k  [RESC1608X05N]
R30  10.0k  [RESC1608X05N]
R31  10.0k  [RESC1608X05N]
R32  10.0k  [RESC1608X05N]
R33  10.0k  [RESC1608X05N]
R34  10.0k  [RESC1608X05N]
R35  10.0k  [RESC1608X05N]
R36  10.0k  [RESC1608X05N]
R37  10.0k  [RESC1608X05N]
R38  10.0k  [RESC1608X05N]
R39  10.0k  [RESC1608X05N]
R40  10.0k  [RESC1608X05N]
R41  10.0k  [RESC1608X05N]
R42  10.0k  [RESC1608X05N]
R43  10.0k  [RESC1608X05N]
R44  0  [RESC1608X05N]
R46  10.0k  [RESC1608X05N]
R47  10.0k  [RESC1608X05N]
R48  0  [RESC1608X05N]
R49  0  [RESC1608X05N]
R50  10.0k  [RESC1608X05N]
R51  10.0k  [RESC1608X05N]
R52  10.0k  [RESC1608X05N]
R53  10.0k  [RESC1608X05N]
R54  10.0k  [RESC1608X05N]
R55  10.0k  [RESC1608X05N]
R56  10.0k  [RESC1608X05N]
R58  10.0k  [RESC1608X05N]
R61  10.0k  [RESC1608X05N]
R62  10.0k  [RESC1608X05N]
R63  10.0k  [RESC1608X05N]
R70  10.0k  [RESC1608X05N]
R71  10.0k  [RESC1608X05N]
R72  10.0k  [RESC1608X05N]
R73  10.0k  [RESC1608X05N]
U2  SN74AVC8T245RHLR  [RHL0024A]
U3  SN74LVC1G32DCKR  [FP-DCK0005A-IPC_A]
U4  SN74LVC1G332DCKR  [FP-DCK0006A-MFG]
U8  SN74LVC1G332DCKR  [FP-DCK0006A-MFG]
U9  SN74LVC1G332DCKR  [FP-DCK0006A-MFG]
U10  SN74LVC1G332DCKR  [FP-DCK0006A-MFG]
U11  SN74LVC1G332DCKR  [FP-DCK0006A-MFG]
U13  SN74AVC8T245RHLR  [RHL0024A]
U15  SN74LVC1G332DCKR  [FP-DCK0006A-MFG]
U17  SN74LVC1G32DCKR  [FP-DCK0005A-IPC_A]

### Ports
EPWN (harness EPWM), Iprot_N[1..6] (in), Iprot_P[1..6] (in), PWM_AH[1..6] (out), PWM_AL[1..6] (out), PWM_Soft_Enable (harness PWM_EN)

### Harnesses
EPWM: EPWM1A, EPWM2A, EPWM2B, EPWM3A, EPWM3B, EPWM1B, EPWM4A, EPWM4B, EPWM5A, EPWM5B, EPWM6A, EPWM6B
PWM_EN: PWM_EN_1, PWM_EN_2

### Nets
3V3: C10.1 C12.1 C13.1 C14.1 C15.1 C16.1 C19.1 C20.1 C21.1 C29.1 R9.2 R16.1 R44.2 R46.1 U2.1(VCCA) U3.5(VCC) U4.5(VCC) U8.5(VCC) U9.5(VCC) U10.5(VCC) U11.5(VCC) U13.1(VCCA) U15.5(VCC) U17.5(VCC)
DC_OV: U11.6(C)
GND: C10.2 C11.2 C12.2 C13.2 C14.2 C15.2 C16.2 C19.2 C20.2 C21.2 C22.2 C29.2 R20.1 R29.1 R30.2 R31.2 R32.2 R33.2 R34.2 R35.2 R36.1 R37.1 R38.1 R39.2 R40.1 R41.1 R42.2 R43.2 R47.1 R50.1 R51.2 R52.2 R53.2 R54.2 R55.2 R56.2 R58.1 R61.1 R62.1 R63.2 R70.1 R71.1 R72.2 R73.2 U2.11(GND) U2.12(GND) U2.13(GND) U2.25(EP) U3.3(GND) U4.2(GND) U8.2(GND) U9.2(GND) U10.2(GND) U11.2(GND) U13.11(GND) U13.12(GND) U13.13(GND) U13.25(EP) U15.2(GND) U17.3(GND)
nEnable1: U2.22(OE_N) U3.4(Y)
nEnable2: U13.22(OE_N) U17.4(Y)
PROTECT: R28.1 R49.1 U8.4(Y)
EPWM1A: R71.2 U13.3(A1) ; port EPWN.EPWM1A
EPWM1B: R70.2 U13.4(A2) ; port EPWN.EPWM1B
EPWM2A: R63.1 U13.5(A3) ; port EPWN.EPWM2A
EPWM2B: R62.2 U13.6(A4) ; port EPWN.EPWM2B
EPWM3A: R61.2 U13.7(A5) ; port EPWN.EPWM3A
EPWM3B: R58.2 U13.8(A6) ; port EPWN.EPWM3B
EPWM4A: R41.2 U2.3(A1) ; port EPWN.EPWM4A
EPWM4B: R40.2 U2.4(A2) ; port EPWN.EPWM4B
EPWM5A: R39.1 U2.5(A3) ; port EPWN.EPWM5A
EPWM5B: R38.2 U2.6(A4) ; port EPWN.EPWM5B
EPWM6A: R37.2 U2.7(A5) ; port EPWN.EPWM6A
EPWM6B: R36.2 U2.8(A6) ; port EPWN.EPWM6B
Iprot+_123: U4.4(Y) U8.1(A)
Iprot+_456: U8.3(B) U9.4(Y)
Iprot-_1-6: U8.6(C) U11.4(Y)
Iprot-_123: U10.4(Y) U11.1(A)
Iprot-_456: U11.3(B) U15.4(Y)
Iprot_N1: U10.1(A)
Iprot_N2: U10.3(B)
Iprot_N3: U10.6(C)
Iprot_N4: U15.1(A)
Iprot_N5: U15.3(B)
Iprot_N6: U15.6(C)
Iprot_P1: U4.1(A)
Iprot_P2: U4.3(B)
Iprot_P3: U4.6(C)
Iprot_P4: U9.1(A)
Iprot_P5: U9.3(B)
Iprot_P6: U9.6(C)
PWM_AH1: R51.1 U13.21(B1)
PWM_AH2: R53.1 U13.19(B3)
PWM_AH3: R55.1 U13.17(B5)
PWM_AH4: R30.1 U2.21(B1)
PWM_AH5: R32.1 U2.19(B3)
PWM_AH6: R34.1 U2.17(B5)
PWM_AL1: R52.1 U13.20(B2)
PWM_AL2: R54.1 U13.18(B4)
PWM_AL3: R56.1 U13.16(B6)
PWM_AL4: R31.1 U2.20(B2)
PWM_AL5: R33.1 U2.18(B4)
PWM_AL6: R35.1 U2.16(B6)
PWM_EN_1: R23.1 ; port PWM_Soft_Enable.PWM_EN_1
PWM_EN_2: R48.1 ; port PWM_Soft_Enable.PWM_EN_2
NetC11_1: C11.1 R9.1 U2.23(VCCB) U2.24(VCCB)
NetC22_1: C22.1 R44.1 U13.23(VCCB) U13.24(VCCB)
NetR16_2: R16.2 U2.2(DIR)
NetR20_2: R20.2 R23.2 U3.1(A)
NetR28_2: R28.2 R29.2 U3.2(B)
NetR42_1: R42.1 U2.9(A7)
NetR43_1: R43.1 U2.10(A8)
NetR46_2: R46.2 U13.2(DIR)
NetR47_2: R47.2 R48.2 U17.1(A)
NetR49_2: R49.2 R50.2 U17.2(B)
NetR72_1: R72.1 U13.9(A7)
NetR73_1: R73.1 U13.10(A8)

Not connected (* = marked no-connect by the designer): U2 14(B8)* 15(B7)*; U13 14(B8)* 15(B7)*

### Buses and harness runs
bus Iprot_N[1..6] = port Iprot_N[1..6]
bus Iprot_P[1..6] = port Iprot_P[1..6]
bus PWM_AH[1..6] = port PWM_AH[1..6]
bus PWM_AL[1..6] = port PWM_AL[1..6]

### Notes on the sheet
- 输入PWM
- 硬件保护
- PWM使能

### Library data of the parts
C10-C16 C19-C22 C29 = Cap: Capacitor; Published: 8-Jun-2000; LatestRevisionDate: 17-Jul-2002; LatestRevisionNote: Re-released for DXP Platform.; PackageReference: RAD-0.3; Publisher: Altium Limited; PackageDescription: Radial Cap, Thru-Hole; 2 Leads; 0.3 in Pin Spacing; Value: 0.1uF
R9 R44 = Res: Resistor 0402; Value: K; Published: 8-Jun-2000; LatestRevisionDate: 17-Jul-2002; LatestRevisionNote: Re-released for DXP Platform.; PackageReference: AXIAL-0.4; Publisher: Altium Limited; PackageDescription: Axial Device, Thru-Hole; 2 Leads; 0.4 in Pin Spacing
R16 R20 R23 R28-R43 R46-R56 R58 R61-R63 R70-R73 = 0603 100KΩ (1003) 1%_4: 贴片电阻; Value: 1MΩ(1%); ComponentLink1Description: 供应商链接; ComponentLink1URL: http://www.szlcsc.com/product/details_26546.html; Package: 0603; Supplier: LC; SuppliersPartNumber: C25803
U2 = SN74AVC8T245RHLR: No Description Available(1.2-3.6V); Mfr_Name: Texas Instruments; CompType: IC; Type: DEV; RefDes: RefDes; Copyright: Copyright (C) 2024 Ultra Librarian. All rights reserved.; Manufacturer_Part_Number: SN74AVC8T245RHLR; PartNumber: SN74AVC8T245RHL; PackageReference: RHL0024A; MountType: SMT; RoHS: Y; Manufacturer: Texas Instruments
U3 U17 = CMP-0859-00376-4: IC GATE OR 1CH 2-INP SC70-5(1.65-5.5V); Turn-On Delay Time: 4.5ns; Schmitt Trigger Input: No; Number of Bits: 1; High Level Output Current: -32mA; Max Supply Voltage: 5.5V; Propagation Delay: 4ns; Max Output Current: 32mA; Min Supply Voltage: 1.65V; Number of Input Lines: 2; Quiescent Current: 10uA; Case/Package: SC; Weight: 8.8E-05oz; Logic Function: OR; Package Quantity: 1; Packaging: Tape and Reel; Mount: Surface Mount; Max Operating Temperature: 125°C; Output Current: 32mA; Length: 2mm; Contact Plating: Gold; Number of Output Lines: 1; Height: 0.9mm; Number of Pins: 5; Width: 1.25mm; REACH SVHC: No SVHC; Number of Circuits: 1; Radiation Hardening: No; Number of Elements: 1; Low Level Output Current: 32mA; Number of Outputs: 1; Min Operating Temperature: -40°C; Number of Inputs: 2; Lead Free: Lead Free; Termination: SMD/SMT; Number of Gates: 1
U4 U8-U11 U15 = CMP-0859-00464-4: IC GATE OR 1CH 3-INP SC70-6; Manufacturer: Texas Instruments; Min Supply Voltage: 1.65V; Number Of Circuits: 1; Nominal Supply Current: 10uA; Number Of Inputs: 3; Max Supply Voltage: 5.5V; Propagation Delay: 20ns; Standoff Height: 0mm; Logic Function Desc: Non-Inverting; Manufacturer Part Number: SN74LVC1G332DCKR; Automotive: No; Temperature: -40°C to +125°C; Device Class L1: Integrated Circuits (ICs); ComponentLink2URL: http://www.ti.com/lit/ds/symlink/sn74lvc1g332.pdf; RoHS: TRUE; Digikey Description: IC GATE OR 1CH 3-INP SC70-6; Octopart: https://octopart.com/sn74lvc1g332dckr-texas+instruments-464861; Ambient Temperature Range Low: -40°C; Number Of Outputs: 1; Height: 1.1mm; Device Class L2: Logic ICs; Mouser Description: Logic Gates Single 3-Input Pos- OR Gate; ComponentLink2Description: Datasheet; Package: DCK0006A; Temperature Range Low: -40°C; Ambient Temperature Range High: +125°C; Temperature Range High: +125°C; Category: IC; Device Class L3: Logic Gates; Lead Free: Yes
U13 = SN74AVC8T245RHLR: No Description Available; Mfr_Name: Texas Instruments; CompType: IC; Type: DEV; RefDes: RefDes; Copyright: Copyright (C) 2024 Ultra Librarian. All rights reserved.; Manufacturer_Part_Number: SN74AVC8T245RHLR; PartNumber: SN74AVC8T245RHL; PackageReference: RHL0024A; MountType: SMT; RoHS: Y; Manufacturer: Texas Instruments

## Sheet motor.SchDoc
size A4
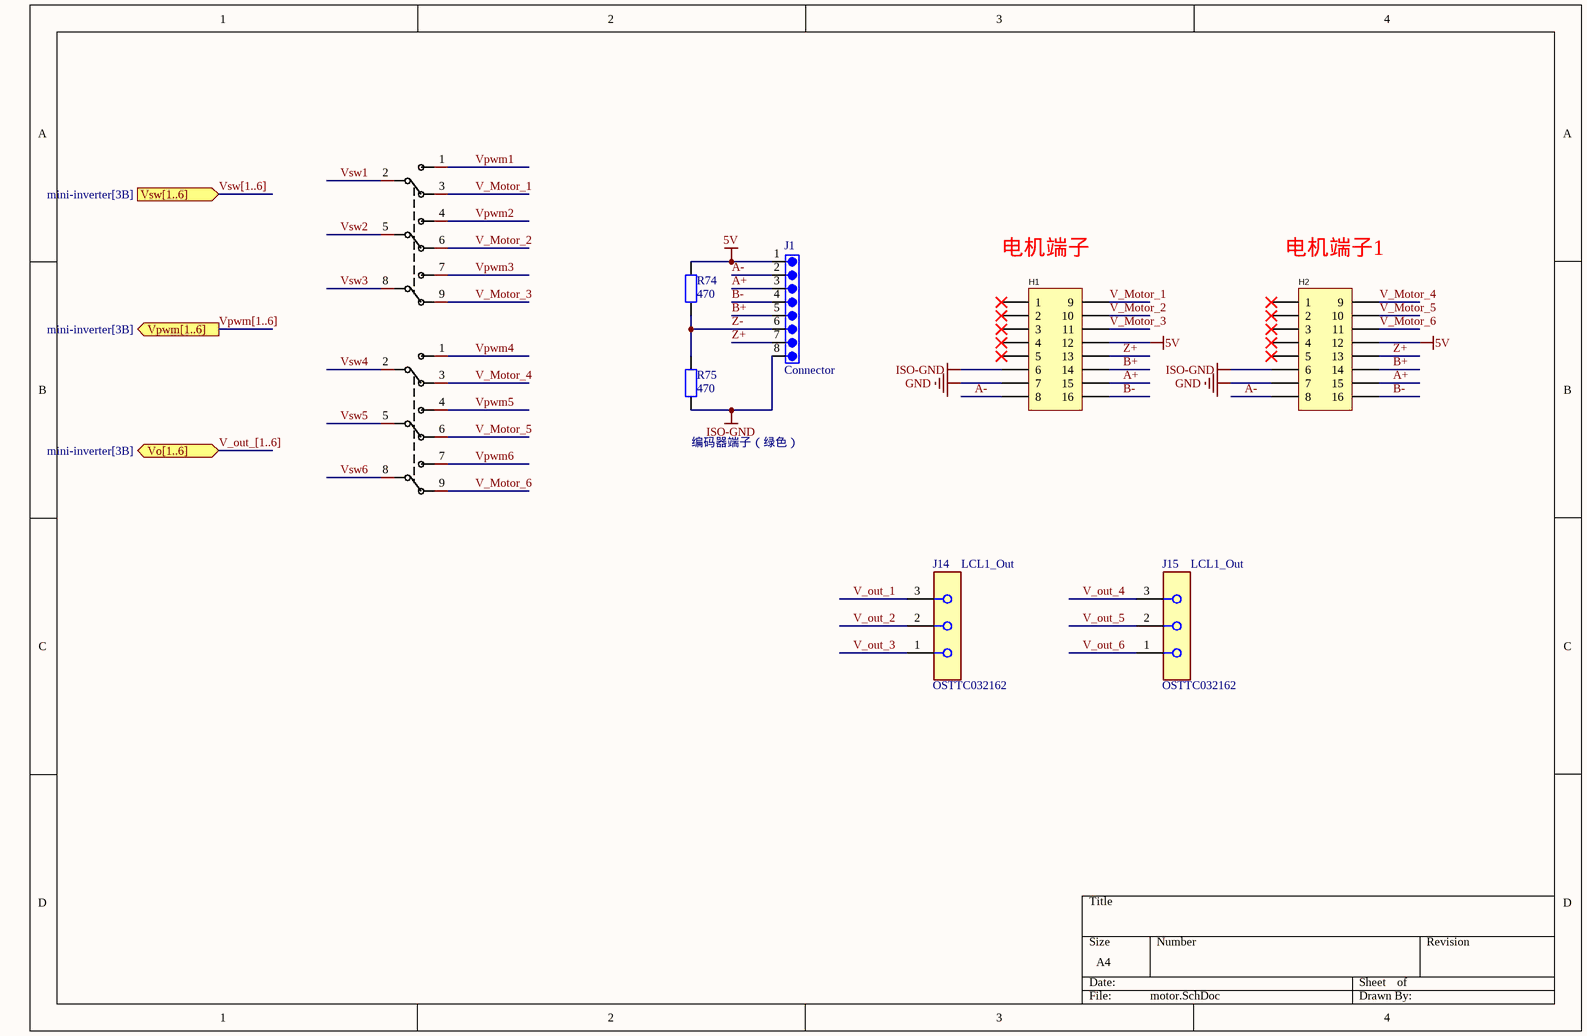
[diagram p5: motor.SchDoc]

### Parts
H1  HC-5557-2*8AW  [CONN-TH_16P-P4.20_5557-2X8AW]  (value not drawn)
H2  HC-5557-2*8AW  [CONN-TH_16P-P4.20_5557-2X8AW]  (value not drawn)
J1  Connector  [691382010008]
J14  LCL1_Out  Part Number: OSTTC032162  [3 Pin Terminal]
J15  LCL1_Out  Part Number: OSTTC032162  [3 Pin Terminal]
R74  470  [RESC1608X05N]
R75  470  [RESC1608X05N]
U18  7307TCWZQE  [SW-TH_9P-L12.7-W16.5-P4.7-LS9.6]  (value not drawn)
U19  7307TCWZQE  [SW-TH_9P-L12.7-W16.5-P4.7-LS9.6]  (value not drawn)

### Ports
Vo[1..6] (bidir, see mini-inverter[3B]), Vpwm[1..6] (out, see mini-inverter[3B]), Vsw[1..6] (in, see mini-inverter[3B])

### Nets
5V: H1.8(12) H2.8(12) J1.1 R74.2
GND: H1.13(7) H2.13(7)
ISO-GND: H1.11(6) H2.11(6) J1.8 R75.1
A+: H1.14(15) H2.14(15) J1.3
A-: H1.15(8) H2.15(8) J1.2
B+: H1.12(14) H2.12(14) J1.5
B-: H1.16 H2.16 J1.4
V_Motor_1: H1.2(9) U18.3
V_Motor_2: H1.4(10) U18.6
V_Motor_3: H1.6(11) U18.9
V_Motor_4: H2.2(9) U19.3
V_Motor_5: H2.4(10) U19.6
V_Motor_6: H2.6(11) U19.9
V_out_1: J14.3
V_out_2: J14.2
V_out_3: J14.1
V_out_4: J15.3
V_out_5: J15.2
V_out_6: J15.1
Vpwm1: U18.1
Vpwm2: U18.4
Vpwm3: U18.7
Vpwm4: U19.1
Vpwm5: U19.4
Vpwm6: U19.7
Vsw1: U18.2
Vsw2: U18.5
Vsw3: U18.8
Vsw4: U19.2
Vsw5: U19.5
Vsw6: U19.8
Z+: H1.10(13) H2.10(13) J1.7
Z-: J1.6 R74.1 R75.2

Not connected (* = marked no-connect by the designer): H1 1* 3(2)* 5(3)* 7(4)* 9(5)*; H2 1* 3(2)* 5(3)* 7(4)* 9(5)*

### Buses and harness runs
bus V_out_[1..6] = port Vo[1..6]
bus Vpwm[1..6] = port Vpwm[1..6]
bus Vsw[1..6] = port Vsw[1..6]

### Notes on the sheet
- (near H1) 电机端子
- (near H2) 电机端子1
- (near R75) 编码器端子（绿色）

### Library data of the parts
H1 H2 = HC-5557-2*8AW: Manufacturer: HCTL(华灿天禄); Add into BOM: yes; Pins Structure: 2x8P; Pitch: 4.2mm; Number of PINs Per Row: 8; Current Rating (Max): 9A; Symbol: HC-5557-2*8AW; Device: HC-5557-2*8AW; LCSC Part Name: 2x8P 间距:4.2mm 弯插; Supplier Part: C2845793; Manufacturer Part: HC-5557-2*8AW; Supplier Footprint: 弯插,P=4.2mm; JLCPCB Part Class: Extended Part; Datasheet: https://atta.szlcsc.com/upload/public/pdf/source/20230620/3AA4118B2C2E81189EA8FE45B17A7E9B.pdf; Supplier: LCSC; Convert to PCB: yes; Mounting Style: 弯插; Reference Series: -; Number of Pins: 16P; Number of Rows: 2; Row Spacing: 4.2mm; Contact Material: 黄铜; Contact Plating: 锡; Operating Temperature Range: -25℃~+85℃
J1 = 691382010008: 8 Position Terminal Block Header, Male Pins, Shrouded (4 Side) 0.098 (2.50mm) 90Â°, Right Angle - Through Hole; Manufacturer: Wurth Elektronik; Availability: In Stock; Package: None; Manufacturer Part Number: 691382010008; Value: *; Purchase-URL: https://pricing.snapeda.com/search/part/691382010008/?ref=eda; SnapEDA_Link: https://www.snapeda.com/parts/691382010008/Wurth+Elektronik/view-part/?ref=snap; Price: None; Check_prices: https://www.snapeda.com/parts/691382010008/Wurth+Elektronik/view-part/?ref=eda
J14 J15 = 3PinTerminal: 3 Position Terminal Block 5.08mm; Manufacturer: On Shore Technology; Voltage: 300V; Is Female: yes; helpURL: https://upverter.com/upn/revision/2b80058b23306b34/; ComponentLink2Description: Datasheet; Temperature: -30°C to +105°C; Package: HDR03; Supplier 2: Mouser; Price: 0.382016875697; Supplier 1: Digi-Key; ComponentLink1URL: https://upverter.com/upn/revision/2b80058b23306b34/; Supplier Part Number 1: ED2610-ND; ComponentLink1Description: Upverter; ComponentLink2URL: https://upverter.com/datasheet/d9a5d2e095ec14efdc364e45047c257fc4ca76eb.pdf; RoHS: TRUE; Temperature Range High: +105°C; Digikey Description: CONN TERM BLOCK 5.08MM VERT 3POS PCB; Digikey Part Number: ED2610-ND; Lead Free: yes; Temperature Range Low: -30°C
R74 R75 = 0603 100KΩ (1003) 1%_4: 贴片电阻; Value: 470Ω(1%); ComponentLink1Description: 供应商链接; ComponentLink1URL: http://www.szlcsc.com/product/details_26546.html; Package: 0603; Supplier: LC; SuppliersPartNumber: C25803
U18 U19 = 7307TCWZQE: Manufacturer: C&K; Add into BOM: yes; Circuit: 三刀双掷; Voltage Rating (AC): 120V; Voltage Rating (DC): 28V; Actuator Type: 圆柱钮柄; Pin Style: 焊片; Symbol: 7307TCWZQE; Device: 7307TCWZQE; LCSC Part Name: 7307TCWZQE 五件套; Supplier Part: C2815234; Manufacturer Part: 7307TCWZQE; Supplier Footprint: 插件; JLCPCB Part Class: Extended Part; Datasheet: https://atta.szlcsc.com/upload/public/pdf/source/20211209/37A386D40B29B4092CECEFBC6A220B9D.pdf; Supplier: LCSC; Convert to PCB: yes; Mounting Style: 直插; Operating Temperature: -30℃~+85℃

## Sheet rtpi.SchDoc
size A4
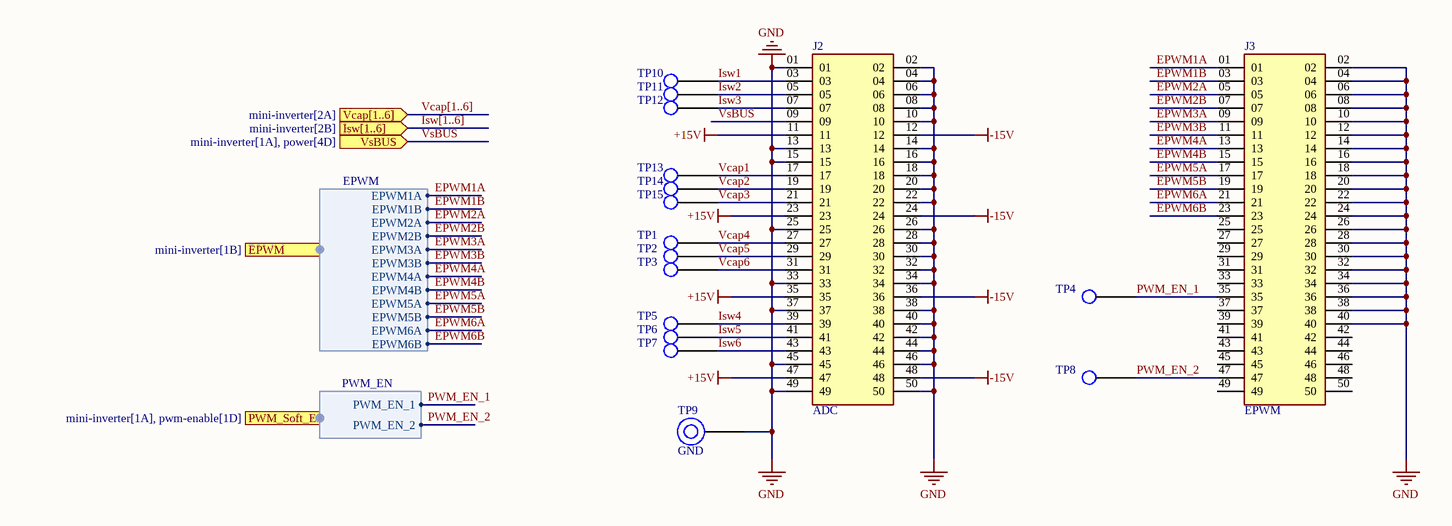
[diagram p6: rtpi.SchDoc]

### Parts
J2  ADC  [SHF-125-01-L-D-RA]
J3  EPWM  [SHF-125-01-L-D-RA]
TP1  VC_1A  [PCB 1.32mm TestPoint]  (value not drawn)
TP2  VC_1B  [PCB 1.32mm TestPoint]  (value not drawn)
TP3  VC_1C  [PCB 1.32mm TestPoint]  (value not drawn)
TP4  PWMEN1  [PCB 1.32mm TestPoint]  (value not drawn)
TP5  I1  [PCB 1.32mm TestPoint]  (value not drawn)
TP6  I2  [PCB 1.32mm TestPoint]  (value not drawn)
TP7  I3  [PCB 1.32mm TestPoint]  (value not drawn)
TP8  PWMEN2  [PCB 1.32mm TestPoint]  (value not drawn)
TP9  GND  [1.9mm Hole]
TP10  VC_1A  [PCB 1.32mm TestPoint]  (value not drawn)
TP11  VC_1B  [PCB 1.32mm TestPoint]  (value not drawn)
TP12  VC_1C  [PCB 1.32mm TestPoint]  (value not drawn)
TP13  VC_1A  [PCB 1.32mm TestPoint]  (value not drawn)
TP14  VC_1B  [PCB 1.32mm TestPoint]  (value not drawn)
TP15  VC_1C  [PCB 1.32mm TestPoint]  (value not drawn)

### Ports
EPWM (harness EPWM, see mini-inverter[1B]), Isw[1..6] (in, see mini-inverter[2B]), PWM_Soft_Enable (harness PWM_EN, see mini-inverter[1A], pwm-enable[1D]), Vcap[1..6] (in, see mini-inverter[2A]), VsBUS (in, see mini-inverter[1A], power[4D])

### Harnesses
EPWM: EPWM1A, EPWM2A, EPWM2B, EPWM3A, EPWM3B, EPWM1B, EPWM4A, EPWM4B, EPWM5A, EPWM5B, EPWM6A, EPWM6B
PWM_EN: PWM_EN_1, PWM_EN_2

### Nets
+15V: J2.11 J2.23 J2.35 J2.47
-15V: J2.12 J2.24 J2.36 J2.48
GND: J2.01 J2.02 J2.04 J2.06 J2.08 J2.10 J2.13 J2.14 J2.15 J2.16 J2.18 J2.20 J2.22 J2.25 J2.26 J2.28 J2.30 J2.32 J2.33 J2.34 J2.37 J2.38 J2.40 J2.42 J2.44 J2.45 J2.46 J2.49 J2.50 J3.02 J3.04 J3.06 J3.08 J3.10 J3.12 J3.14 J3.16 J3.18 J3.20 J3.22 J3.24 J3.26 J3.28 J3.30 J3.32 J3.34 J3.36 J3.38 J3.40 TP9.1
EPWM1A: J3.01 ; port EPWM.EPWM1A
EPWM1B: J3.03 ; port EPWM.EPWM1B
EPWM2A: J3.05 ; port EPWM.EPWM2A
EPWM2B: J3.07 ; port EPWM.EPWM2B
EPWM3A: J3.09 ; port EPWM.EPWM3A
EPWM3B: J3.11 ; port EPWM.EPWM3B
EPWM4A: J3.13 ; port EPWM.EPWM4A
EPWM4B: J3.15 ; port EPWM.EPWM4B
EPWM5A: J3.17 ; port EPWM.EPWM5A
EPWM5B: J3.19 ; port EPWM.EPWM5B
EPWM6A: J3.21 ; port EPWM.EPWM6A
EPWM6B: J3.23 ; port EPWM.EPWM6B
Isw1: J2.03 TP10.1
Isw2: J2.05 TP11.1
Isw3: J2.07 TP12.1
Isw4: J2.39 TP5.1
Isw5: J2.41 TP6.1
Isw6: J2.43 TP7.1
PWM_EN_1: J3.35 TP4.1 ; port PWM_Soft_Enable.PWM_EN_1
PWM_EN_2: J3.47 TP8.1 ; port PWM_Soft_Enable.PWM_EN_2
Vcap1: J2.17 TP13.1  [project net V_cap1_1]
Vcap2: J2.19 TP14.1  [project net V_cap2_1]
Vcap3: J2.21 TP15.1  [project net V_cap3_1]
Vcap4: J2.27 TP1.1  [project net V_cap4_1]
Vcap5: J2.29 TP2.1  [project net V_cap5_1]
Vcap6: J2.31 TP3.1  [project net V_cap6_1]
VsBUS: J2.09 ; port VsBUS

Not connected (* = marked no-connect by the designer): J3 25 27 29 31 33 37 39 41 42 43 44 45 46 48 49 50

### Buses and harness runs
bus Isw[1..6] = port Isw[1..6]
bus Vcap[1..6] = port Vcap[1..6]

### Library data of the parts
J2 J3 = SHF-125-01-L-D-RA: 50-Pin Simplus Connector; MF: Samtec; MP: SHF-125-01-L-D-RA; Package: None; Price: None; Availability: Unavailable; Value: *
TP1-TP8 TP10-TP15 = PCBTestpoint: 20-313143 PCB Test Point, White, Through Hole Mount, 1.32 mm, Phosphor Bronze, Tin Plated Contacts
TP9 = GroundTestPoint: H2182-01 PCB Test Point, PCB Mount, 1.9 mm, Brass, Tin Plated Contacts

## Nets that join several sheets
3V3: bridge1 (U5_1.5 U7_1.5), bridge2 (U5_2.5 U7_2.5), bridge3 (U5_3.5 U7_3.5), bridge4 (U5_4.5 U7_4.5), bridge5 (U5_5.5 U7_5.5), bridge6 (U5_6.5 U7_6.5), power (9 pins), pwm-enable (24 pins)
5V: bridge1 (R1_1.2), bridge2 (R1_2.2), bridge3 (R1_3.2), bridge4 (R1_4.2), bridge5 (R1_5.2), bridge6 (R1_6.2), power (9 pins), motor (H1.8 H2.8 J1.1 R74.2)
5VA: bridge1 (10 pins), bridge2 (10 pins), bridge3 (10 pins), bridge4 (10 pins), bridge5 (10 pins), bridge6 (10 pins), power (C23.2 L1.2)
C1_Neut: bridge1 (17 pins), bridge2 (17 pins), bridge3 (17 pins), bridge4 (17 pins), bridge5 (17 pins), bridge6 (17 pins)
CompRef1: bridge1 (U5_1.4), bridge2 (U5_2.4), bridge3 (U5_3.4), bridge4 (U5_4.4), bridge5 (U5_5.4), bridge6 (U5_6.4), power (C31.2 R83.1)
CompRef2: bridge1 (R27_1.2), bridge2 (R27_2.2), bridge3 (R27_3.2), bridge4 (R27_4.2), bridge5 (R27_5.2), bridge6 (R27_6.2), power (C30.2 R84.1)
DC_OV: power (R18.1 U6.1), pwm-enable (U11.6)
GND: bridge1 (22 pins), bridge2 (22 pins), bridge3 (22 pins), bridge4 (22 pins), bridge5 (22 pins), bridge6 (22 pins), power (29 pins), pwm-enable (60 pins), motor (H1.13 H2.13), rtpi (50 pins)
PGND: bridge1 (5 pins), bridge2 (5 pins), bridge3 (5 pins), bridge4 (5 pins), bridge5 (5 pins), bridge6 (5 pins), power (5 pins)
VBUS: bridge1 (5 pins), bridge2 (5 pins), bridge3 (5 pins), bridge4 (5 pins), bridge5 (5 pins), bridge6 (5 pins), power (7 pins)
EPWM1A: pwm-enable (R71.2 U13.3), rtpi (J3.01)
EPWM1B: pwm-enable (R70.2 U13.4), rtpi (J3.03)
EPWM2A: pwm-enable (R63.1 U13.5), rtpi (J3.05)
EPWM2B: pwm-enable (R62.2 U13.6), rtpi (J3.07)
EPWM3A: pwm-enable (R61.2 U13.7), rtpi (J3.09)
EPWM3B: pwm-enable (R58.2 U13.8), rtpi (J3.11)
EPWM4A: pwm-enable (R41.2 U2.3), rtpi (J3.13)
EPWM4B: pwm-enable (R40.2 U2.4), rtpi (J3.15)
EPWM5A: pwm-enable (R39.1 U2.5), rtpi (J3.17)
EPWM5B: pwm-enable (R38.2 U2.6), rtpi (J3.19)
EPWM6A: pwm-enable (R37.2 U2.7), rtpi (J3.21)
EPWM6B: pwm-enable (R36.2 U2.8), rtpi (J3.23)
Iprot_N1: bridge1 (R25_1.1 U7_1.1), pwm-enable (U10.1)
Iprot_N2: bridge2 (R25_2.1 U7_2.1), pwm-enable (U10.3)
Iprot_N3: bridge3 (R25_3.1 U7_3.1), pwm-enable (U10.6)
Iprot_N4: bridge4 (R25_4.1 U7_4.1), pwm-enable (U15.1)
Iprot_N5: bridge5 (R25_5.1 U7_5.1), pwm-enable (U15.3)
Iprot_N6: bridge6 (R25_6.1 U7_6.1), pwm-enable (U15.6)
Iprot_P1: bridge1 (R15_1.1 U5_1.1), pwm-enable (U4.1)
Iprot_P2: bridge2 (R15_2.1 U5_2.1), pwm-enable (U4.3)
Iprot_P3: bridge3 (R15_3.1 U5_3.1), pwm-enable (U4.6)
Iprot_P4: bridge4 (R15_4.1 U5_4.1), pwm-enable (U9.1)
Iprot_P5: bridge5 (R15_5.1 U5_5.1), pwm-enable (U9.3)
Iprot_P6: bridge6 (R15_6.1 U5_6.1), pwm-enable (U9.6)
Isw1: bridge1 (R13_1.2 R26_1.2 R67_1.1), rtpi (J2.03 TP10.1)
Isw2: bridge2 (R13_2.2 R26_2.2 R67_2.1), rtpi (J2.05 TP11.1)
Isw3: bridge3 (R13_3.2 R26_3.2 R67_3.1), rtpi (J2.07 TP12.1)
Isw4: bridge4 (R13_4.2 R26_4.2 R67_4.1), rtpi (J2.39 TP5.1)
Isw5: bridge5 (R13_5.2 R26_5.2 R67_5.1), rtpi (J2.41 TP6.1)
Isw6: bridge6 (R13_6.2 R26_6.2 R67_6.1), rtpi (J2.43 TP7.1)
PWM_AH1: bridge1 (R2_1.2), pwm-enable (R51.1 U13.21)
PWM_AH2: bridge2 (R2_2.2), pwm-enable (R53.1 U13.19)
PWM_AH3: bridge3 (R2_3.2), pwm-enable (R55.1 U13.17)
PWM_AH4: bridge4 (R2_4.2), pwm-enable (R30.1 U2.21)
PWM_AH5: bridge5 (R2_5.2), pwm-enable (R32.1 U2.19)
PWM_AH6: bridge6 (R2_6.2), pwm-enable (R34.1 U2.17)
PWM_AL1: bridge1 (R3_1.2), pwm-enable (R52.1 U13.20)
PWM_AL2: bridge2 (R3_2.2), pwm-enable (R54.1 U13.18)
PWM_AL3: bridge3 (R3_3.2), pwm-enable (R56.1 U13.16)
PWM_AL4: bridge4 (R3_4.2), pwm-enable (R31.1 U2.20)
PWM_AL5: bridge5 (R3_5.2), pwm-enable (R33.1 U2.18)
PWM_AL6: bridge6 (R3_6.2), pwm-enable (R35.1 U2.16)
PWM_EN_1: pwm-enable (R23.1), rtpi (J3.35 TP4.1)
PWM_EN_2: pwm-enable (R48.1), rtpi (J3.47 TP8.1)
V_out_1: bridge1 (L4_1.2), motor (J14.3)
V_out_2: bridge2 (L4_2.2), motor (J14.2)
V_out_3: bridge3 (L4_3.2), motor (J14.1)
V_out_4: bridge4 (L4_4.2), motor (J15.3)
V_out_5: bridge5 (L4_5.2), motor (J15.2)
V_out_6: bridge6 (L4_6.2), motor (J15.1)
Vpwm1: bridge1 (L3_1.1), motor (U18.1)
Vpwm2: bridge2 (L3_2.1), motor (U18.4)
Vpwm3: bridge3 (L3_3.1), motor (U18.7)
Vpwm4: bridge4 (L3_4.1), motor (U19.1)
Vpwm5: bridge5 (L3_5.1), motor (U19.4)
Vpwm6: bridge6 (L3_6.1), motor (U19.7)
VsBUS: power (C104.1 R8.1 R17.2), rtpi (J2.09)
Vsw1: bridge1 (R64_1.2 R65_1.1), motor (U18.2)
Vsw2: bridge2 (R64_2.2 R65_2.1), motor (U18.5)
Vsw3: bridge3 (R64_3.2 R65_3.1), motor (U18.8)
Vsw4: bridge4 (R64_4.2 R65_4.1), motor (U19.2)
Vsw5: bridge5 (R64_5.2 R65_5.1), motor (U19.5)
Vsw6: bridge6 (R64_6.2 R65_6.1), motor (U19.8)